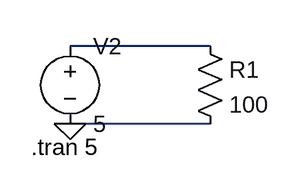
[diagram p0: schematic erste_Simulation.asc]
erste_Simulation.asc, the LTspice schematic file:
Version 4
SHEET 1 880 680
WIRE 192 144 48 144
WIRE 192 224 48 224
FLAG 48 224 0
SYMBOL res 176 128 R0
SYMATTR InstName R1
SYMATTR Value 100
SYMBOL voltage 48 128 R0
WINDOW 123 0 0 Left 0
WINDOW 39 0 0 Left 0
SYMATTR InstName V2
SYMATTR Value 5
TEXT 8 248 Left 2 !.tran 5

The netlist it stands for:
* erste_Simulation.asc
R1 N001 0 100
V2 N001 0 5
.tran 5
.backanno
.end